# Altium project 2012_BALISE_CONNECTIQUE_FILLE.PRJPCB
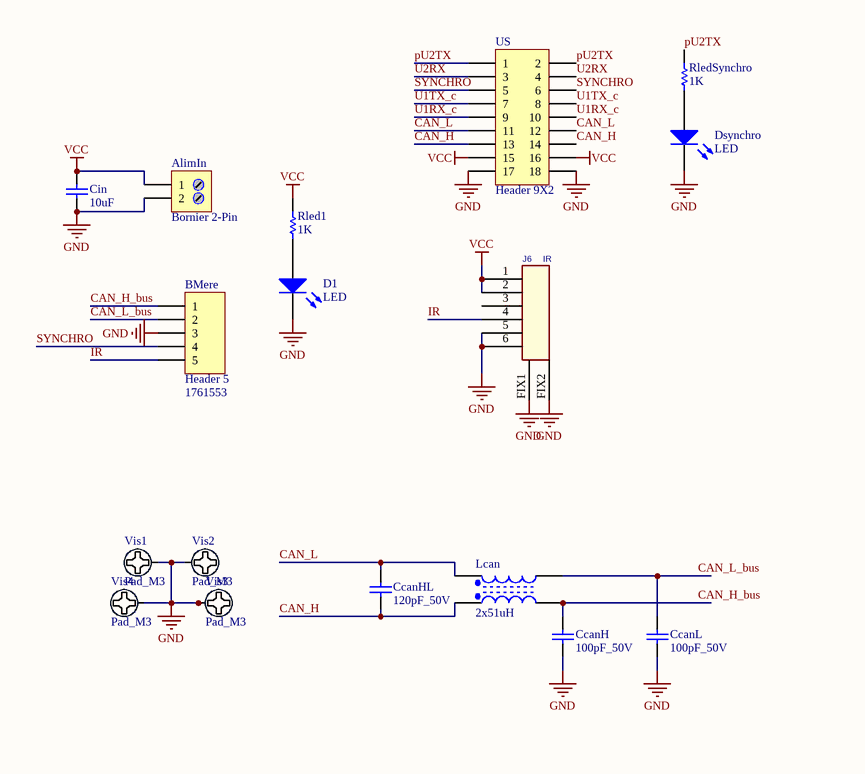
[diagram p0: 2012_BALISE_CONNECTIQUE_FILLE.SchDoc, left]
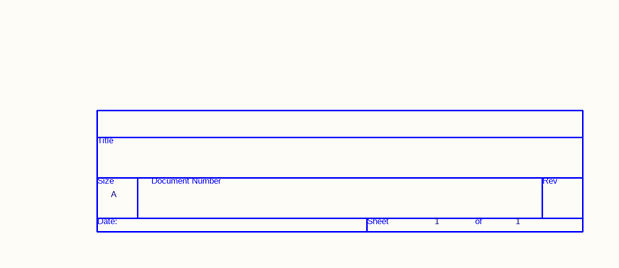
[diagram p1: 2012_BALISE_CONNECTIQUE_FILLE.SchDoc, right]
1 sheet, 18 parts. Net scope: global (net labels, ports and power ports of the same name join across sheets).
Board file: 2012_BALISE_CONNECTIQUE_FILLE.PCBDOC

## Sheet 2012_BALISE_CONNECTIQUE_FILLE.SchDoc
size A4

### Parts
*  Page Count: 1  Page Size: A  (hidden comment: TitleBlock0)  (graphical)
AlimIn  Bornier 2-Pin  [Bornier_2_pas 5.08mm]
BMere  Header 5  FAR: 1761553  [HDR1X5]
CcanH  100pF_50V  [C0603_N]
CcanHL  120pF_50V  [C0603_N]
CcanL  100pF_50V  [C0603_N]
Cin  10uF  [C1206_N]
D1  LED  [LED_0805]
Dsynchro  LED  [LED_0805]
J6  IR  [RJ11_6/6]
Lcan  2x51uH  [Self de mode commun Wurth Elektronik WE-SL2]
Rled1  1K  [R1206_N]
RledSynchro  1K  [R1206_N]
US  Header 9X2  [HDR2X9]
Vis1  Pad_M3  [M3x6mm]
Vis2  Pad_M3  [M3x6mm]
Vis3  Pad_M3  [M3x6mm]
Vis4  Pad_M3  [M3x6mm]

### Nets
GND: AlimIn.2 BMere.3 CcanH.1 CcanL.1 Cin.1 D1.2 Dsynchro.2 J6.5 J6.6 J6.FIX1 J6.FIX2 US.17 US.18 Vis1.1 Vis2.1 Vis3.1 Vis4.1
VCC: AlimIn.1 Cin.2 J6.1 J6.2 Rled1.2 US.15 US.16
CAN_H: CcanHL.1 Lcan.1 US.13 US.14
CAN_H_bus: BMere.1 CcanH.2 Lcan.4
CAN_L: CcanHL.2 Lcan.2 US.11 US.12
CAN_L_bus: BMere.2 CcanL.2 Lcan.3
IR: BMere.5 J6.4
pU2TX: RledSynchro.2 US.1 US.2
SYNCHRO: BMere.4 US.5 US.6
U1RX_c: US.9 US.10
U1TX_c: US.7 US.8
U2RX: US.3 US.4
NetD1_1: D1.1 Rled1.1
NetDsynchro_1: Dsynchro.1 RledSynchro.1

Not connected (* = marked no-connect by the designer): J6 3

### Notes on the sheet
- Title
- Size:
- Date:
- A4
- Number:
- Time:
- Revision:
- Sheet
- of
- File:
- (in symbol TitleBlock0) Title; Size; Document Number; Rev; Date:; Sheet; of

### Library data of the parts
BMere = Header 5: Header, 5-Pin; LatestRevisionDate: 17-Jul-2002; LatestRevisionNote: Re-released for DXP Platform.; Publisher: Altium Limited
CcanH CcanL = Capacitor: FAR: 722080; Published: 8-Jun-2000; LatestRevisionDate: 17-Jul-2002; LatestRevisionNote: Re-released for DXP Platform.; PackageReference: RAD-0.3; Publisher: Altium Limited
CcanHL = Capacitor: FAR: 722042; Published: 8-Jun-2000; LatestRevisionDate: 17-Jul-2002; LatestRevisionNote: Re-released for DXP Platform.; PackageReference: RAD-0.3; Publisher: Altium Limited
Cin = Capacitor: Published: 8-Jun-2000; LatestRevisionDate: 17-Jul-2002; LatestRevisionNote: Re-released for DXP Platform.; PackageReference: RAD-0.3; Publisher: Altium Limited
D1 Dsynchro = LED: Typical LED; Published: 8-Jun-2000; LatestRevisionDate: 08-Jul-2005; LatestRevisionNote: Mech Layer 1 removed.; PackageReference: LED-1; Publisher: Altium Limited
J6 = CONNECTEUR_RJ12
Lcan = Self de mode commun WE-744220: Self de mode commun, Wurth Elektronik, WE-SL2; Manufacturer Part Number: WE-SL2 744 227; Inductance: 4.7; DC Current Rating: 500; Max DC Resistance: 0.75; Core Material: Ferrite; Inductor Case Style: 74422; Tolérance d'inductance: ± 50%; Description: WUERTH ELEKTRONIK - WE-SL2 744 227 - FILTRE DE LIGNE MODE COMMUN CMS 2X51uH; FAR: 1636267; RoHS: YES; Série: WE-SL2; Category: Composants passifs; ComponentLink1URL: http://www.farnell.com/datasheets/70375.pdf; ComponentLink1Description: http://www.farnell.com/datasheets/70375.pdf; Pricing: 1=2,1, 10=1,95, 50=1,8, 100=1,69, 250=1,59 (EUR); Manufacturer: WURTH ELEKTRONIK
Rled1 RledSynchro = Resistor: Published: 8-Jun-2000; LatestRevisionDate: 17-Jul-2002; LatestRevisionNote: Re-released for DXP Platform.; PackageReference: AXIAL-0.5; Publisher: Altium Limited
US = Header 9X2: Header, 9-Pin, Dual row; LatestRevisionDate: 17-Jul-2002; LatestRevisionNote: Re-released for DXP Platform.; Publisher: Altium Limited
Vis1-Vis4 = Vis M3 X 6mm _TORX_Tête 6mm: Publisher: Damien Guitton
* = TitleBlock0: Page Number: 1; Page Create Date: March  8, 1995
AlimIn = Bornier 2-Pin: LatestRevisionDate: 17-Jul-2002; LatestRevisionNote: Re-released for DXP Platform.; Publisher: Altium Limited